# Altium schematic sheet E3.SchDoc
size 420 x 297 mm; Author: Гостев М.А.; CompanyName: ИУ4.11.03.03.25.08.82.08.000 Э3; Address1: Схема электрическая принципиальная; SheetNumber: 1; SheetTotal: 1; Mass: Сканирующее устройство
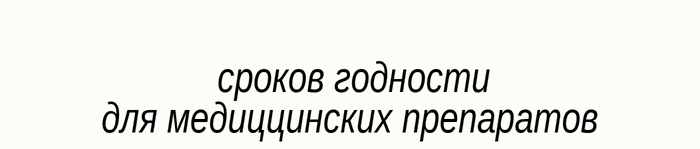
[diagram p0: E3.SchDoc]

## Notes on the sheet
- сроков годности
- для медиццинских препаратов
- Перв. примен.
- Справ. №
- Подп. и дата
- Инв. № дубл.
- Взам. инв. №
- Разраб.
- Изм.
- Лист
- № докум.
- Подп.
- Дата
- Лит.
- Масса
- Масштаб
- Пров.
- Т.контр.
- Листов
- 1
- Инв. № подл.
- Утв.
- Н.контр.
- МГТУ им Н. Э. Баумана
- Группа ИУ4-82Б
- Кафедра ИУ4
- 2.106-A3
- Копировал
- Формат А3